# EAGLE schematic raspi-adapter (EAGLE 6.5.0)
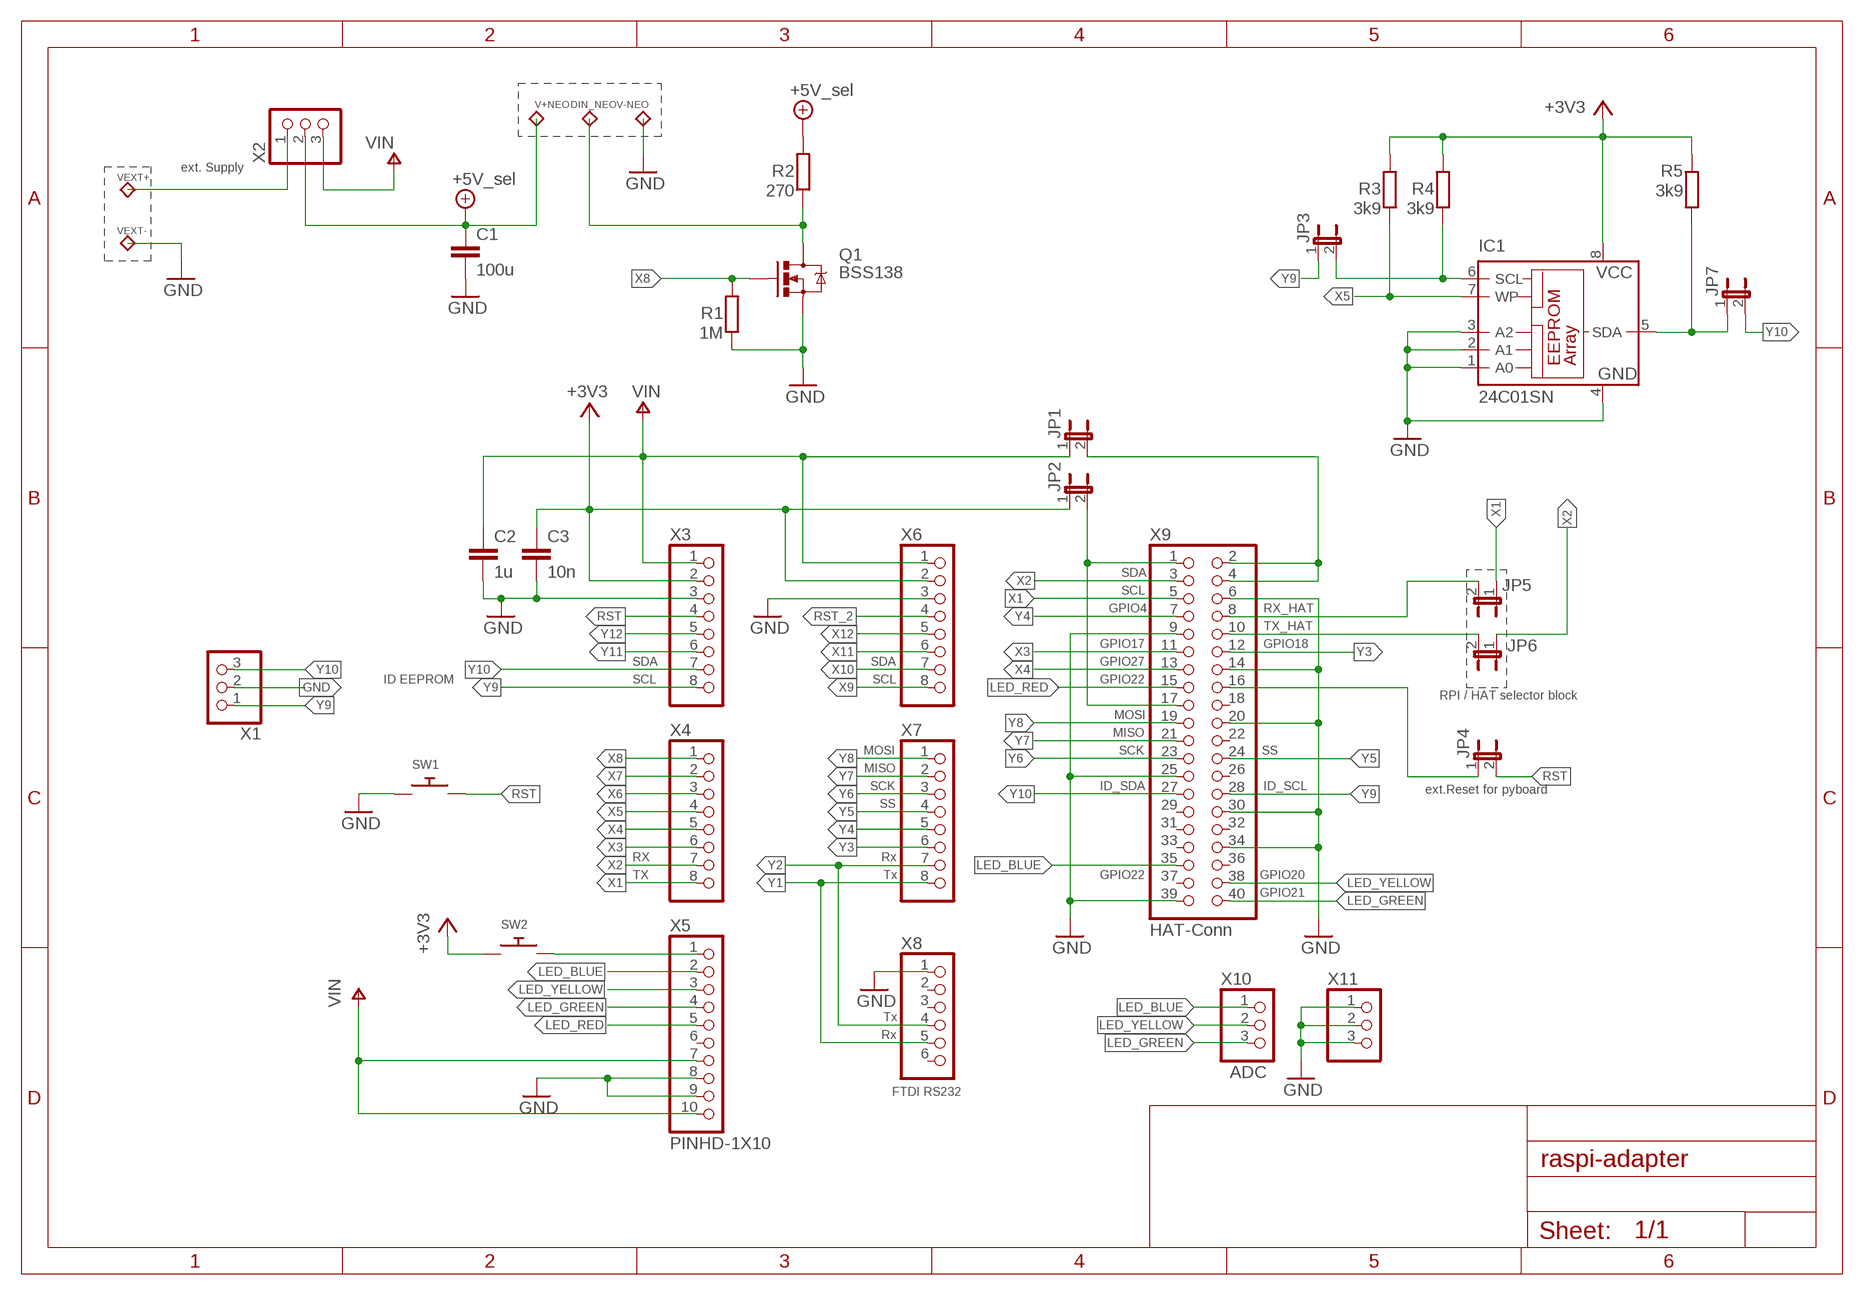
[diagram p0: schematic, sheet 1]

## Parts
C1  100u  C-EUC1210  [C1210]
C2  1u  C-EUC0603  [C0603]
C3  10n  C-EUC0603  [C0603]
DIN_NEO  TP_BATT  [TP_BATT_GROSS]
IC1  24C01SN  [SO-08]
JP1  JUMPER-2PTH  [1X02]
JP2  JUMPER-2PTH  [1X02]
JP3  JUMPER-2PTH  [1X02]
JP4  JUMPER-2PTH  [1X02]
JP5  JUMPER-2PTH  [1X02]
JP6  JUMPER-2PTH  [1X02]
JP7  JUMPER-2PTH  [1X02]
Q1  BSS138  MOSFET-NCHANNELBSS123LT1G  [SOT23]
R1  1M  R-EU_R0603  [R0603]
R2  270  R-EU_R0603  [R0603]
R3  3k9  R-EU_R0603  [R0603]
R4  3k9  R-EU_R0603  [R0603]
R5  3k9  R-EU_R0603  [R0603]
SW1  SWITCH_PUSHBUTTONSOFTTOUCHSMD_SJ  [PUSHBUTTON_SMD_SJ]
SW2  SWITCH_PUSHBUTTONSOFTTOUCHSMD_SJ  [PUSHBUTTON_SMD_SJ]
V+NEO  V+NEO  TP_BATT  [TP_BATT_GROSS]
V-NEO  TP_BATT  [TP_BATT_GROSS]
VEXT+  TP_BATT  [TP_BATT_GROSS]
VEXT-  TP_BATT  [TP_BATT_GROSS]
X1  PINHD-1X3  [1X03]
X2  PINHD-1X3  [1X03]
X3  PINHD-1X8CLEANBIG  [1X08-CLEANBIG]
X4  PINHD-1X8CLEANBIG  [1X08-CLEANBIG]
X5  PINHD-1X10  [1X10-BIG]
X6  PINHD-1X8CLEANBIG  [1X08-CLEANBIG]
X7  PINHD-1X8CLEANBIG  [1X08-CLEANBIG]
X8  PINHD-1X6B  [1X06-BIG]
X9  HAT-Conn  PINHD-2X20  [2X20]
X10  PINHD-1X3  [1X03]
X11  PINHD-1X3  [1X03]

## Nets
3V3_RPI: JP2.2 X9.1 X9.17
+3V3: C3.1 IC1.8(VCC) JP2.1 R3.2 R4.2 R5.2 SW2.P$1 X3.2 X6.2
+5V: C1.1 R2.2 V+NEO.1 X2.2 ; supply symbol labelled +5V_sel
GND: C1.2 C2.2 C3.2 IC1.1(A0) IC1.2(A1) IC1.3(A2) IC1.4(GND) Q1.2(S) R1.1 SW1.P$1 V-NEO.1 VEXT-.1 X1.2 X3.3 X5.8 X5.9 X6.3 X8.1 X9.6 X9.9 X9.14 X9.20 X9.25 X9.30 X9.34 X9.39 X11.1 X11.2 X11.3
LED_BLUE: X5.2 X9.35 X10.1
LED_GREEN: X5.4 X9.40 X10.3
LED_RED: X5.5 X9.15
LED_YELLOW: X5.3 X9.38 X10.2
N$2: VEXT+.1 X2.1
N$4: SW2.P$2 X5.1
N$6: DIN_NEO.1 Q1.3(D) R2.1
N$7: JP4.1 X9.16
RST: JP4.2 SW1.P$2 X3.4
RST_2: X6.4
SCL: IC1.6(SCL) JP3.2 R4.1
SDA: IC1.5(SDA) JP7.1 R5.1
V+: C2.1 JP1.1 X2.3 X3.1 X6.1 ; supply symbol labelled VIN
VIN: X5.7 X5.10
VIN_RPI: JP1.2 X9.2 X9.4
X1: JP5.1 X4.8 X9.5
X1_: JP5.2 X9.8
X2: JP6.1 X4.7 X9.3
X2_2: JP6.2 X9.10
X3: X4.6 X9.11
X4: X4.5 X9.13
X5: IC1.7(WP) R3.1 X4.4
X6: X4.3
X7: X4.2
X8: Q1.1(G) R1.2 X4.1
X9: X6.8
X10: X6.7
X11: X6.6
X12: X6.5
Y1: X7.8 X8.5
Y2: X7.7 X8.4
Y3: X7.6 X9.12
Y4: X7.5 X9.7
Y5: X7.4 X9.24
Y6: X7.3 X9.23
Y7: X7.2 X9.21
Y8: X7.1 X9.19
Y9: JP3.1 X1.1 X3.8 X9.28
Y10: JP7.2 X1.3 X3.7 X9.27
Y11: X3.6
Y12: X3.5
Unconnected: X5.6 X8.2 X8.3 X8.6 X9.18 X9.22 X9.26 X9.29 X9.31 X9.32 X9.33 X9.36 X9.37

## Notes on the sheet
- ext. Supply
- SDA
- SCL
- GPIO4 | RX_HAT
- TX_HAT
- GPIO17 | GPIO18
- SDA | SDA | GPIO27
- ID EEPROM | SCL | SCL | GPIO22
- RPI / HAT selector block
- MOSI
- MISO
- SCK | SS
- MOSI
- MISO
- SCK
- ID_SDA | ID_SCL
- ext.Reset for pyboard
- SS
- RX | Rx
- TX | Tx | GPIO22 | GPIO20
- GPIO21
- Tx
- Rx
- ADC
- FTDI RS232

## Library data of the parts
C1-C3 = rcl:C-EU: CAPACITOR, European symbol
DIN_NEO V+NEO V-NEO VEXT+ VEXT- = GasDemo:TP_BATT
IC1 = microchip:24C*: Serial EEPROM 1 K/2 K/4 K; MPN: CAT24C01WI-GT3; OC_FARNELL: 1718117; OC_NEWARK: 06R0487
JP1-JP7 = SparkFun-Passives:JUMPER-2: Jumper Basic 0.1" spaced jumper. Use with breakaway headers.
Q1 = SparkFun-DiscreteSemi:MOSFET-NCHANNEL: Common NMOSFET Parts MFG P/N Store ID Prod ID FDD8780 TRANS-09984 SI7820DN TRANS-11055 FDS6630A IC-08089 2N7002PW TRANS-11151 FQP30N06L COM-10213 TRANS-10060 BSS123LT1G TRANS-08345 BSS138 TRANS-00830 BS170 2N7000; PROD_ID: TRANS-08345
R1-R5 = resistor:R-EU_: RESISTOR, European symbol
SW1 SW2 = adafruit:SWITCH_PUSHBUTTON: Buttons SOFTTOUCHSMD_SJ - Soft touch temporary push button (Super Junk Akihabara) Compatible with SKPMANE010 [Mouser: 688-SKPMAN] C&K_KSS = Digikey: KSS221GLFS
X1 X2 X10 X11 = adafruit:PINHD-1X3: PIN HEADER
X3 X4 X6 X7 = adafruit:PINHD-1X8: PIN HEADER
X5 = adafruit:PINHD-1X10: Pin header 1x10 0.1" spacing With round pins
X8 = adafruit:PINHD-1X6: PIN HEADER
X9 = adafruit:PINHD-2X20: PIN HEADER